# EAGLE design A3979Breakout (EAGLE 5.08)
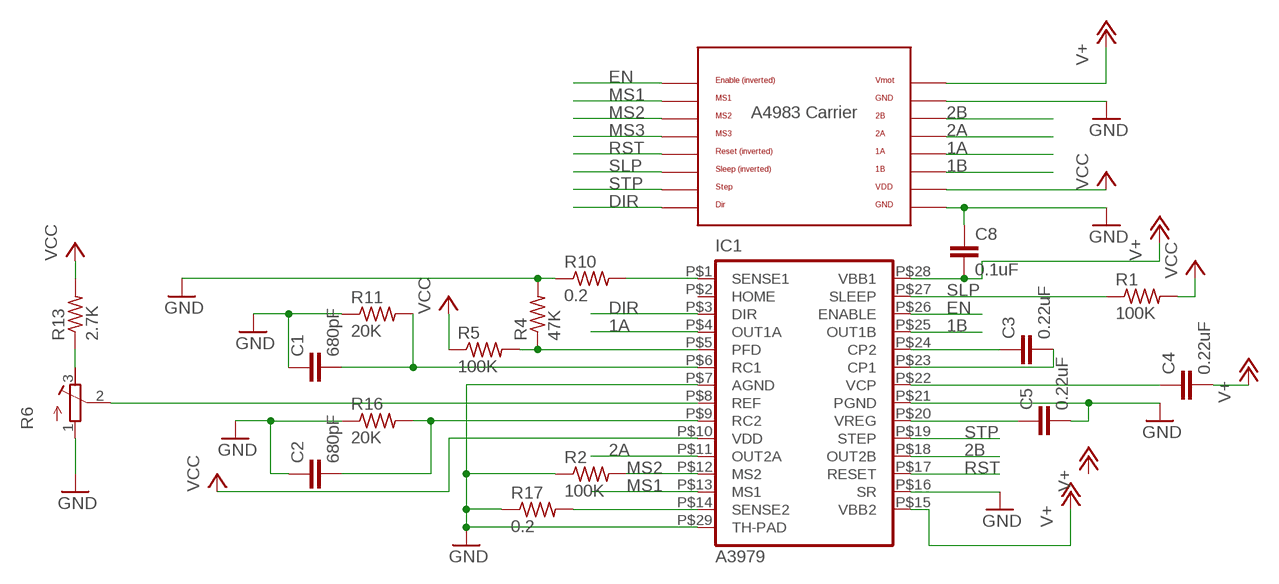
[diagram p0: schematic, sheet 1]

## Parts
C1  680pF  C-EUC0402  [C0402]
C2  680pF  C-EUC0402  [C0402]
C3  0.22uF  C-EUC0603  [C0603]
C4  0.22uF  C-EUC0603  [C0603]
C5  0.22uF  C-EUC0603  [C0603]
C8  0.1uF  C-EUC0402  [C0402]
IC1  A3979  [TSSOP28]
R1  100K  R-US_R0402  [R0402]
R2  100K  R-US_R0402  [R0402]
R4  47K  R-US_R0402  [R0402]
R5  100K  R-US_R0402  [R0402]
R6  R-TRIMM22AR  [RTRIM22AR]
R10  0.2  R-US_R0402  [R0402]
R11  20K  R-US_R0402  [R0402]
R13  2.7K  R-US_R0402  [R0402]
R16  20K  R-US_R0402  [R0402]
R17  0.2  R-US_R0402  [R0402]
U$1  POLOLU_A4983CARRIER  [A3979BREAKOUT]

## Nets
1A: IC1.P$4(OUT1A) U$1.1A
1B: IC1.P$25(OUT1B) U$1.1B
2A: IC1.P$11(OUT2A) U$1.2A
2B: IC1.P$18(OUT2B) U$1.2B
+12V: C4.2 C8.2 IC1.P$15(VBB2) IC1.P$28(VBB1) U$1.VMOT ; supply symbol labelled V+
DIR: IC1.P$3(DIR) U$1.DIR
EN: IC1.P$26(ENABLE) U$1.EN
GND: C1.1 C2.1 C5.2 C8.1 IC1.P$7(AGND) IC1.P$16(SR) IC1.P$21(PGND) IC1.P$29(TH-PAD) R2.1 R4.2 R6.1(E) R10.1 R11.1 R16.1 R17.1 U$1.GND U$1.GND@0(GND)
MS1: IC1.P$13(MS1) U$1.MS1
MS2: IC1.P$12(MS2) R2.2 U$1.MS2
MS3: U$1.MS3
N$3: IC1.P$1(SENSE1) R10.2
N$4: R6.3(A) R13.1
N$5: IC1.P$14(SENSE2) R17.2
N$6: IC1.P$5(PFD) R4.1 R5.2
N$7: IC1.P$8(REF) R6.2(S)
N$9: C1.2 IC1.P$6(RC1) R11.2
N$10: C2.2 IC1.P$9(RC2) R16.2
N$11: C3.1 IC1.P$24(CP2)
N$12: C3.2 IC1.P$23(CP1)
N$13: C4.1 IC1.P$22(VCP)
N$14: C5.1 IC1.P$20(VREG)
RST: IC1.P$17(RESET) U$1.RST
SLP: IC1.P$27(SLEEP) R1.1 U$1.SLP(SLEEP)
STP: IC1.P$19(STEP) U$1.STEP
VCC: IC1.P$10(VDD) R1.2 R5.1 R13.2 U$1.VDD
Unconnected: IC1.P$2(HOME)

## Library data of the parts
C1-C5 C8 = resistor:C-EU: CAPACITOR, European symbol
IC1 = RepRapjr:A3979: DMOS Stepper Motor Driver with Translator Auto generated by make-symbol-device-package-bsdl.ulp Rev. 32 Source: http://www.allegromicro.com/en/Products/Part_Numbers/3982/3982.pdf
R1 R2 R4 R5 R10 R11 R13 R16 R17 = resistor:R-US_: RESISTOR, American symbol
R6 = RepRapjr:R-TRIMM: Trimm resistor
U$1 = RepRapjr:POLOLU_A4983CARRIER

## Board
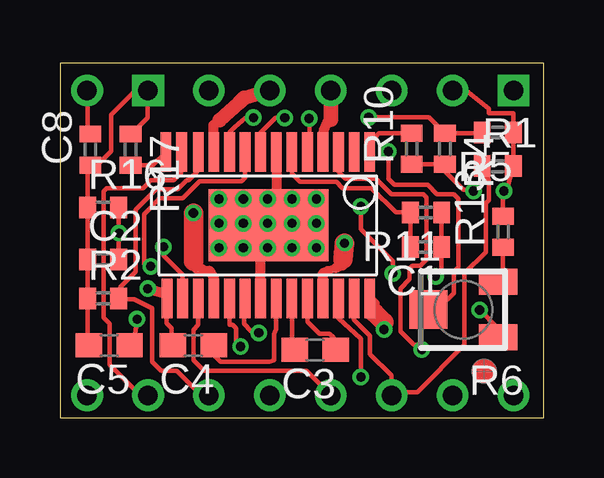
[diagram p1: board, top side]
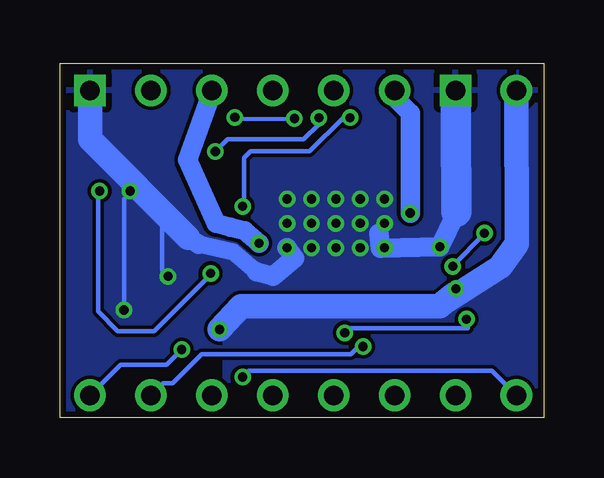
[diagram p2: board, bottom side, seen from below]

Size 20.17 x 14.78 mm. Coordinates in mm from the lower left corner, seen from the top.
Outline: 0,0 20.17,0 20.17,14.78 0,14.78 0,0
Copper layers (1*16): Top 0.035mm / dielectric 1.5mm / Bottom 0.035mm
Design rules: minimum track width 6mil, minimum drill 12mil, track to track 6mil, track to pad 6mil, pad to pad 6mil, via to via 6mil, smd to smd 0mil, copper to edge 10mil, drill to drill 10mil, minimum pad ring 10mil, minimum via ring 6mil, stop-mask expansion 2mil, vias tented up to drill 100mil, thermal gap 10mil

### Footprints (pad centres in the part's own frame; a part is rotated, then mirrored left to right if it is on the bottom)
C0402 = smd 0.7 x 0.9: 1 -0.65,0; 2 0.65,0
C0603 = smd 1.1 x 1: 1 -0.85,0; 2 0.85,0
TSSOP28 = smd 0.45 x 1.65: P$1 -4.23,0.83; P$2 -3.58,0.83; P$3 -2.93,0.83; P$4 -2.28,0.83; P$5 -1.63,0.83; P$6 -0.98,0.83; P$7 -0.33,0.83; P$8 0.32,0.83; P$9 0.97,0.83; P$10 1.62,0.83; P$11 2.27,0.83; P$12 2.92,0.83; P$13 3.62,0.83; P$14 4.27,0.83; P$15 4.22,6.93; P$16 3.57,6.93; P$17 2.92,6.93; P$18 2.27,6.93; P$19 1.62,6.93; P$20 0.97,6.93; P$21 0.32,6.93; P$22 -0.33,6.93; P$23 -0.98,6.93; P$24 -1.63,6.93; P$25 -2.28,6.93; P$26 -2.93,6.93; P$27 -3.58,6.93; P$28 -4.23,6.93 | smd 5 x 3: P$29 0,3.875
R0402 = smd 0.7 x 0.9: 1 -0.65,0; 2 0.65,0
RTRIM22AR = smd 1.09 x 1.6: 1 -1.155,-1.45; 3 1.155,-1.45 | smd 1.6 x 1.6: 2 0,1.45
A3979BREAKOUT = drill 0.813: 1A 8.89,1.27; 1B 11.43,1.27; 2A 6.35,1.27; 2B 3.81,1.27; DIR 16.51,-11.43; EN -1.27,-11.43; MS1 1.27,-11.43; MS2 3.81,-11.43; MS3 6.35,-11.43; RST 8.89,-11.43; SLP 11.43,-11.43; STEP 13.97,-11.43; VDD 13.97,1.27; VMOT -1.27,1.27 | drill 0.813 square: GND 16.51,1.27; GND@0 1.27,1.27

### Placement (x,y rotation side)
C1  15.26,7.12 180 top
C2  1.8,6.6 0 top
C3  10.64,2.83 180 top
C4  5.56,3.02 180 top
C5  2.06,3.02 180 top
C8  1.27,11.18 90 top
E$1  [FIDUCIAL_L10]  17.69,1.94 0 top
IC1  8.69,11.9 180 top
R1  18.25,10.49 0 top
R2  1.8,4.98 0 top
R4  16.05,11.21 270 top
R5  18.25,11.88 180 top
R6  16.81,4.51 90 top
R10  14.67,11.21 90 top
R11  15.26,8.56 180 top
R13  18.48,7.75 90 top
R16  1.8,8.76 0 top
R17  2.95,11.18 270 top
U$1  2.4,12.37 0 top

### Tracks (layer width: path | path; a pad name or v marks a point on that pad's centre or on a via)
1A
  Top 0.406: 11.3,12.42 11.15,12.32 11,11.94 11,11.05 IC1.P$4
  Top 0.61: U$1.1A 11.29,12.64 11.3,12.42
1B  (via drill 0.38)
  Top 0.356: 11.18,6.12 11.51,6.25
  Top 0.406: IC1.P$25 10.97,5.9 10.97,6.04 11.18,6.12 | 11.51,6.25 11.79,6.35 11.81,6.6
  Top 0.813: 11.81,6.6 v11.87,7.28
  Bottom 0.813: U$1.1B 13.83,13.58 14.84,10.76 13.67,8.1 13.06,7.95 12.47,7.8 v11.87,7.28
2A
  Top 0.406: 6.65,12.39 6.5,12.29 6.4,12.19 6.4,11.18 IC1.P$11
  Top 0.61: U$1.2A 7.72,13.33 7.67,13.33 7.47,13.13 6.65,12.39
2B  (via drill 0.38)
  Top 0.356: 6.22,6.12 5.92,6.2
  Top 0.406: IC1.P$18 6.42,5.83 6.25,6.12 6.22,6.12 | 5.92,6.2 5.69,6.22 5.56,6.53
  Top 0.813: 5.56,6.53 v5.56,8.53
  Bottom 0.813: U$1.2B 6.24,13.38 5.56,12.7 v5.56,8.53
+12V  (via drill 0.38)
  Top 0.178: U$1.VMOT 1.15,13.62 1.15,11.94 C8.2 | 4.42,4.92 IC1.P$15 4.44,4.95 4.44,3.94 4.66,3.72 4.66,3.08 C4.2 | 4.43,5 4.41,5.03 | IC1.P$28 12.92,4.61 12.91,4.61 | 12.91,4.61 12.91,4.9 | 12.91,4.61 12.81,4.51
  Top 0.406: IC1.P$15 4.43,5 4.43,5.18 v3.66,5.38 | 13.12,4.37 13.12,4.77 IC1.P$28
  Top 0.61: v13.51,3.68 13.51,3.97
  Top 0.813: 13.51,3.97 13.12,4.37
  Bottom 0.406: v3.66,5.38 3.78,5.04 4.28,4.71
  Bottom 1.016: U$1.VMOT 1.11,7.25 1.8,6.3 4.28,4.71 3.75,5.16 4.32,4.65 12.61,4.65 v13.51,3.68
  pour Bottom: 0.89,14.51 1.01,14.51 1.05,14.47 1.05,7.54 4.17,4.43 12.48,4.43 13.31,3.61 13.31,0.11 0.04,0.11 -0.03,0.05 -0.03,14.53 0.23,14.48
DIR  (via drill 0.38)
  Top 0.178: IC1.P$3 11.62,10.25 11.91,9.96 13.18,9.96 13.82,9.32 15.15,9.32 15.28,9.19 15.28,6.59 15.02,6.34 14.71,6.34 14.58,6.21 14.58,5.77 14.2,5.38 14.2,3.61 14.77,3.03 14.9,3.03 v15.09,2.84
  Bottom 0.178: U$1.DIR 17.64,2.21 15.72,2.21 v15.09,2.84
EN  (via drill 0.38)
  Top 0.178: IC1.P$26 11.62,4.16 12.55,3.29 v12.55,1.7
  Bottom 0.178: v12.55,1.7 12.29,1.96 2.15,1.96 U$1.EN
GND  (via drill 0.38)
  Top 0.178: 8.06,6.89 8.25,7.09 8.26,7.09 | 9.04,10.61 IC1.P$7 | v4.32,7.12 4.32,6.76 5.11,5.97 5.11,4.98 IC1.P$16 | 8.26,7.09 8.37,6.97 8.37,7.06 8.81,7.51 9.04,7.51 | 8.26,7.09 v8.66,7.09 8.69,7.11 IC1.P$29 | R11.1 C1.1 15.91,6.15 v15.66,5.89 | R17.1 2.97,11.83 3.66,12.51 3.66,13.63 U$1.GND@0 3.15,13.64 2.13,12.62 2.13,11.1 1.56,10.53 C8.1 1.15,10.21 R16.1 C2.1 R2.1 1.15,3.08 C5.2 | v17.25,9.45 17.19,9.51 16.81,9.51 16.05,10.27 R4.2 R10.1 | R6.1 18.26,3.73 v17.5,4.5
  Top 0.406: 9.04,7 9.04,7.51 9.04,10.61 | IC1.P$21 8.37,6.97
  Bottom 0.178: v17.25,9.45 16.81,9.51 16.81,8.95 15.91,8.05 15.91,6.15 v15.66,5.89 | v17.5,4.5 17.5,9.13 16.97,9.66
  Bottom 0.711: 14.39,7.23 12.93,6.91 11.98,6.08
  Bottom 0.813: 6.86,7.7 6.81,7.06 v4.32,7.12 3.66,8.51 3.63,8.58 | 14.39,7.23 14.81,7.51 | 11.98,6.08 11.28,5.89 10.39,6.65 v10.69,7.09
  Bottom 1.016: U$1.GND 18.91,11.61 16.97,9.66 16.81,9.51 14.81,7.51
  Bottom 1.27: 3.63,8.58 3.66,12.3 U$1.GND@0
  other vias: 8.66,9.12 6.63,7.09 6.63,8.1 6.63,9.12 7.65,9.12 7.65,8.1 7.65,7.09 9.68,7.09 10.69,8.1 9.68,8.1 9.68,9.12 10.69,9.12 8.66,8.1
  pour Bottom: 0,14.5 0,0.08 20.04,0.08 20.04,14.53 0,14.53
MS1
  Top 0.178: U$1.MS1 3.34,0.94 2.07,2.21 2.07,3.92 1.82,4.18 1.82,9.45 1.94,9.58 3.47,9.58 3.78,9.89 4.74,9.89 5.05,10.21 5.05,11.06 IC1.P$13
MS2
  Top 0.178: R2.2 2.45,4.87 | IC1.P$12 5.71,11.02 5.71,10.26 5.36,9.91 5.28,9.91 4.9,9.52 4.01,9.52 3.15,8.66 3.15,6.08 2.51,5.45 2.51,5.04 R2.2 | U$1.MS2 5.88,0.94 4.86,1.96 4.23,1.96 3.85,2.34 3.85,4.56 3.09,4.94 2.49,4.94 R2.2
N$3
  Top 0.178: IC1.P$1 12.92,11.47 13.31,11.86 14.63,11.86 R10.2
N$4
  Top 0.178: R13.1 18.48,5.88 R6.3
N$5
  Top 0.178: R17.2 3.87,10.53 IC1.P$14
N$6  (via drill 0.38)
  Top 0.178: IC1.P$5 10.41,11.17 10.41,12.45 v10.39,12.47 | v12.88,12.52 15.39,12.52 R4.1 17.33,11.86 R5.2
  Bottom 0.178: v10.39,12.47 12.8,12.45 v12.88,12.52
N$7  (via drill 0.38)
  Top 0.178: 15.85,4.24 15.63,4.24 R6.2 | IC1.P$8 8.37,11.87 8.99,12.5 v9.37,12.5 | v13.69,11.1 13.69,9.96 13.94,9.7 15.34,9.7 15.72,9.32 16.42,9.32 16.61,9.13 16.61,6.27 16.42,6.08 16.42,5.19 16.17,4.94 15.79,4.94 R6.2 | 15.47,5 15.47,4.61 R6.2
  Bottom 0.178: v9.37,12.5 9.37,12.24 10.01,11.61 13.18,11.61 v13.69,11.1
N$9
  Top 0.178: IC1.P$6 9.67,10.17 10.01,9.83 11.53,9.83 11.79,9.58 12.99,9.58 14.01,8.56 R11.2 C1.2
N$10  (via drill 0.38)
  Top 0.178: IC1.P$9 7.72,10 7.57,9.85 5.82,9.85 5.11,9.14 4.17,9.14 3.51,8.48 3.51,6.4 3.63,6.4 v3.78,6.31 | R16.2 v2.45,7.71 v2.46,7.7 2.45,7.69 C2.2
  Bottom 0.178: v2.46,7.7 v3.78,6.31
N$11
  Top 0.178: IC1.P$24 10.32,4.01 10.81,3.51 11.25,3.51 11.4,3.35 11.4,2.86 C3.1
N$12
  Top 0.178: IC1.P$23 9.67,2.89 C3.2
N$13
  Top 0.178: IC1.P$22 9.02,3.7 8.93,3.48 8.93,2.4 8.74,2.34 6.71,2.34 6.41,2.63 C4.1
N$14  (via drill 0.38)
  Top 0.178: IC1.P$20 7.72,4.75 7.7,4.72 7.67,4.75 7.67,3.91 7.98,3.61 v8.29,3.54 | 2.9,3.03 C5.1 3.09,3.2 v3.21,4.11
  Bottom 0.178: v8.29,3.54 8.23,3.73 3.15,3.73 v3.21,4.11
RST
  Top 0.178: IC1.P$17 5.77,3.88 5.56,3.67 5.56,2.4 6.01,1.96 10.28,1.96 U$1.RST
SLP
  Top 0.178: IC1.P$27 12.27,4.08 12.93,3.42 12.93,2.65 13.82,1.76 13.82,0.96 U$1.SLP 13.96,1.07 14.9,1.07 16.87,3.03 16.87,6.02 17.75,6.91 17.75,8.94 17.88,9.07 17.88,9.87 R1.1
STP  (via drill 0.38)
  Top 0.178: IC1.P$19 7.07,3.88 7.19,3.88 7.34,3.73 7.34,3.16 v7.53,2.97
  Bottom 0.178: v7.53,2.97 7.72,2.97 8.04,2.65 14.26,2.65 15.47,1.45 15.87,1.45 U$1.STEP
VCC  (via drill 0.38)
  Top 0.178: v18.52,9.45 18.5,9.53 | IC1.P$10 7.07,11.91 7.28,12.12 7.74,12.5 v8.07,12.51 | U$1.VDD 16.93,13.64 17.88,12.88 17.88,12.69 18.9,12.69 18.9,12.4 R5.1 R1.2 18.65,9.58 v18.52,9.45 | R13.2 18.48,9.41 v18.52,9.45 | v12.55,8.81 12.55,7.86 13.88,6.53 v13.88,6.02
  Bottom 0.178: v18.52,9.45 18.58,9.38 18.58,4.43 17.75,3.61 16.23,3.61 13.88,5.96 v13.88,6.02 | v8.07,12.51 8.34,12.51 9.75,11.1 12.23,11.1 12.48,10.85 12.48,8.88 v12.55,8.81

### Text on the board
_bsilk: UltiMachine.com/UMA3979B | U | v1b